# Altium schematic sheet HD3SS460-PORT2.SchDoc
size A3; SheetNumber: 5; SheetTotal: 9
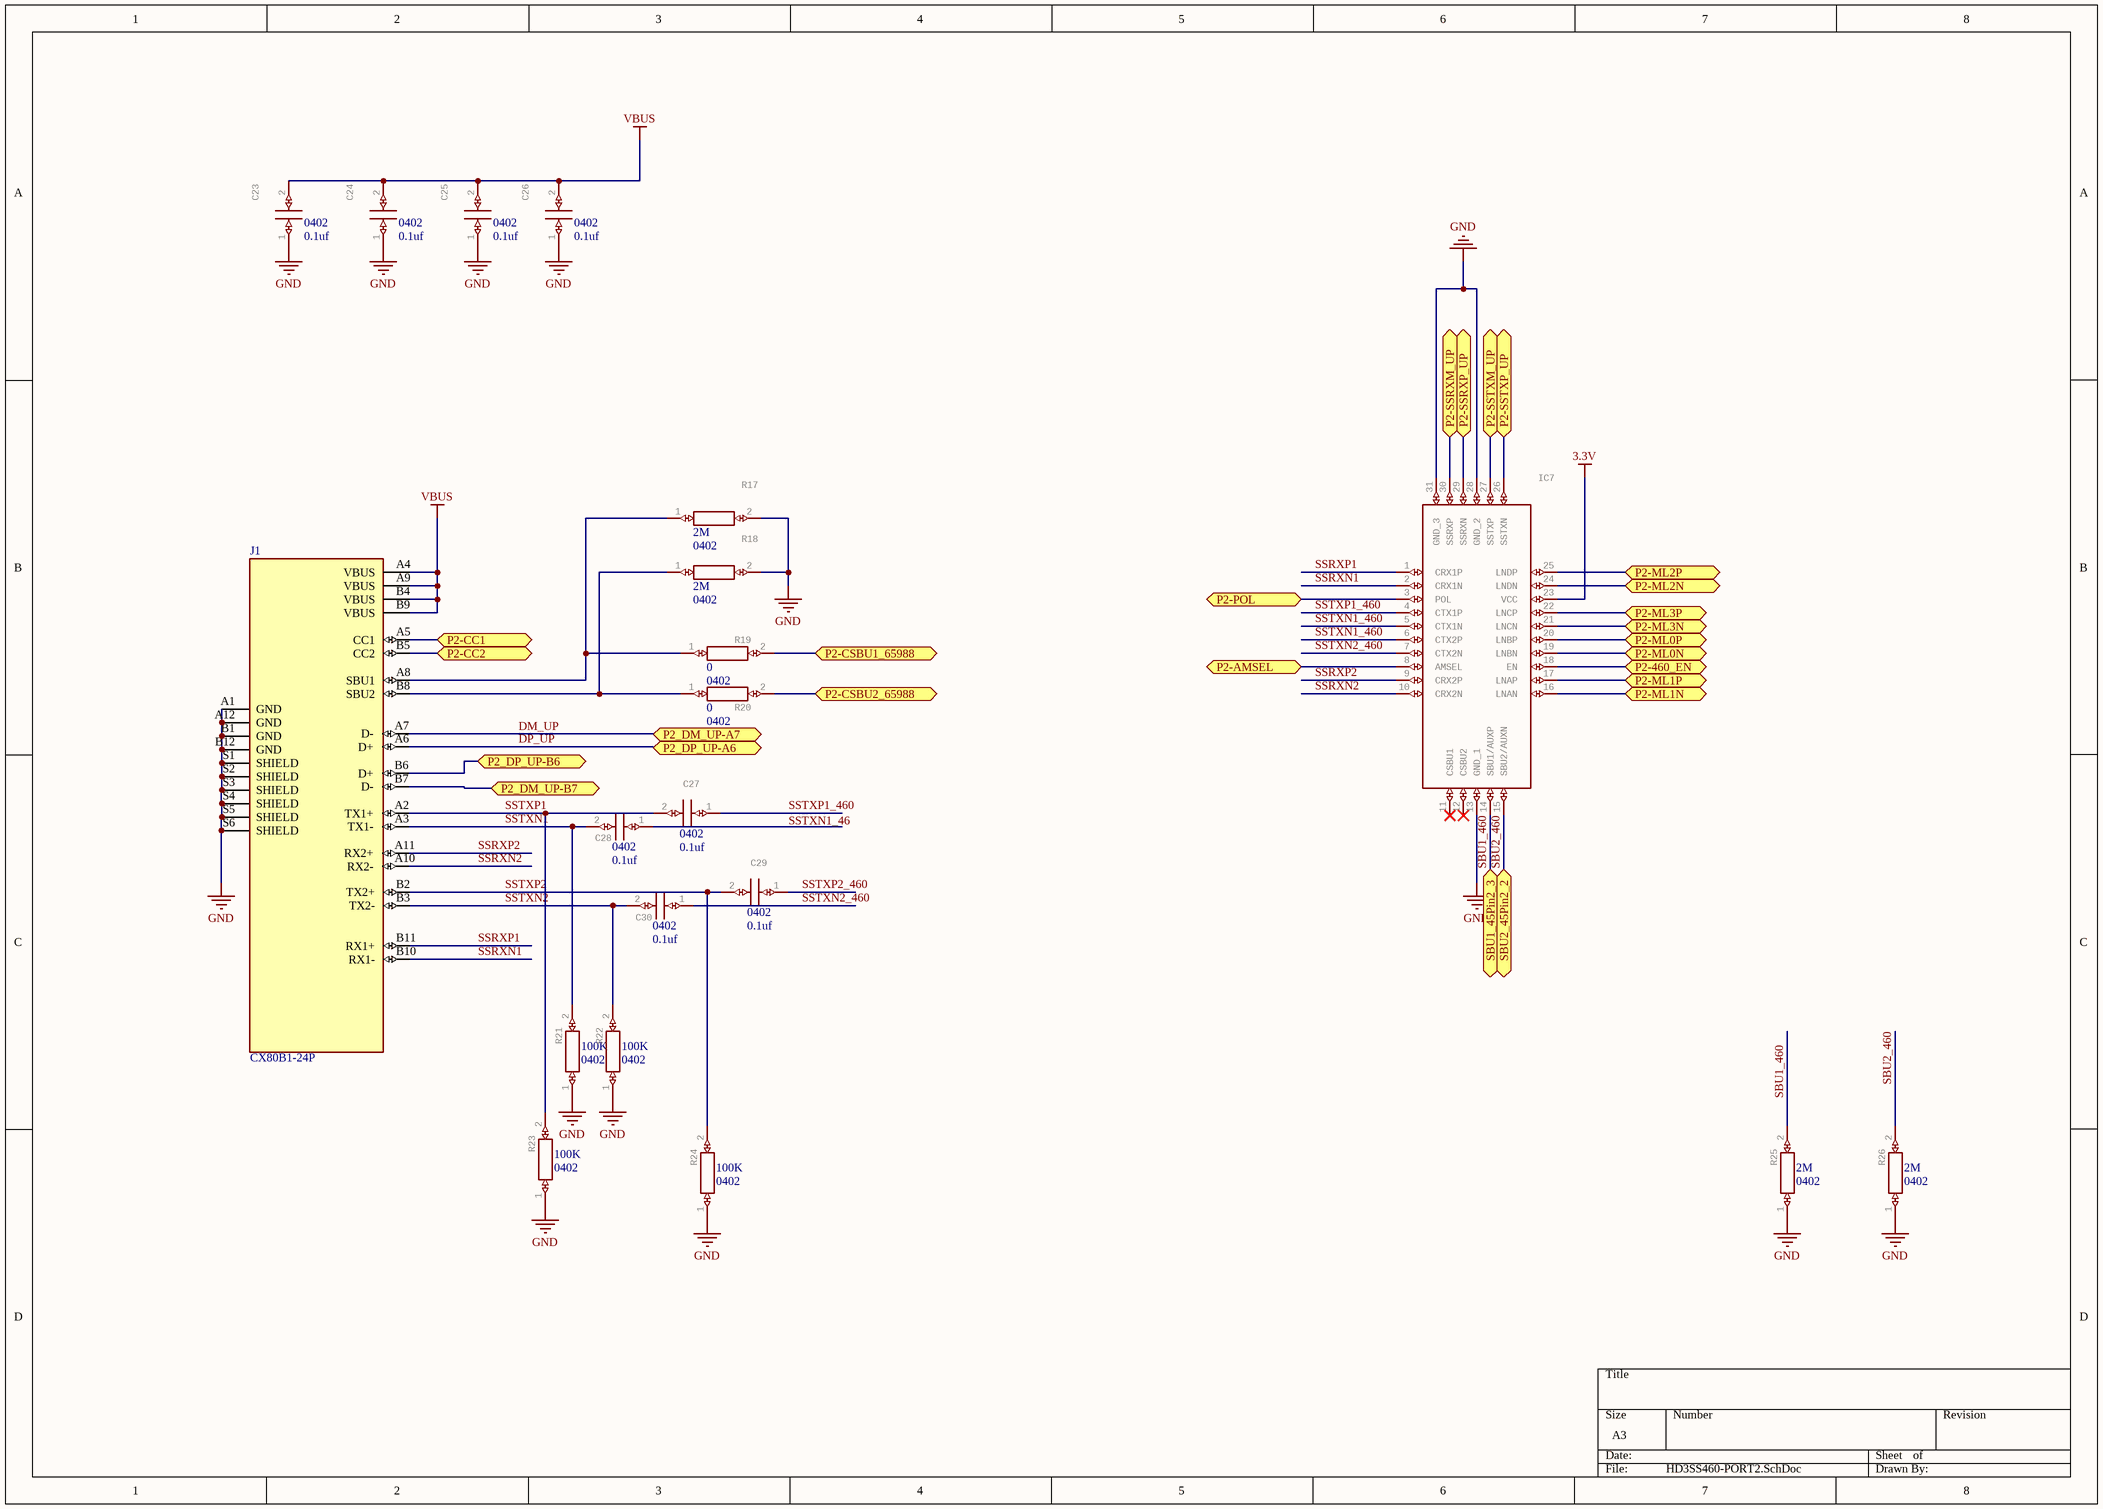
[diagram p0: HD3SS460-PORT2.SchDoc]

## Parts
C23  value 0.1uf  Package: 0402  [CAPC1005X56N]  (hidden comment: Multilayer Ceramic Capacitors MLCC - SMD/SMT 50V .1uF X7R 0402 10% Tol   Source:  Datasheet)
C24  value 0.1uf  Package: 0402  [CAPC1005X56N]  (hidden comment: Multilayer Ceramic Capacitors MLCC - SMD/SMT 50V .1uF X7R 0402 10% Tol   Source:  Datasheet)
C25  value 0.1uf  Package: 0402  [CAPC1005X56N]  (hidden comment: Multilayer Ceramic Capacitors MLCC - SMD/SMT 50V .1uF X7R 0402 10% Tol   Source:  Datasheet)
C26  value 0.1uf  Package: 0402  [CAPC1005X56N]  (hidden comment: Multilayer Ceramic Capacitors MLCC - SMD/SMT 50V .1uF X7R 0402 10% Tol   Source:  Datasheet)
C27  value 0.1uf  Package: 0402  [CAPC1005X56N]  (hidden comment: Multilayer Ceramic Capacitors MLCC - SMD/SMT 50V .1uF X7R 0402 10% Tol   Source:  Datasheet)
C28  value 0.1uf  Package: 0402  [CAPC1005X56N]  (hidden comment: Multilayer Ceramic Capacitors MLCC - SMD/SMT 50V .1uF X7R 0402 10% Tol   Source:  Datasheet)
C29  value 0.1uf  Package: 0402  [CAPC1005X56N]  (hidden comment: Multilayer Ceramic Capacitors MLCC - SMD/SMT 50V .1uF X7R 0402 10% Tol   Source:  Datasheet)
C30  value 0.1uf  Package: 0402  [CAPC1005X56N]  (hidden comment: Multilayer Ceramic Capacitors MLCC - SMD/SMT 50V .1uF X7R 0402 10% Tol   Source:  Datasheet)
IC7  USB Type-C Alternate Mode 4x6 Differential Switch   Source:  Datasheet  [QFN40P250X450X80-31N]  (value not drawn)
J1  CX80B1-24P  [HIROSE_CX80B1-24P]
R17  value 2M  Package: 0402  [RESC1005X40N]  (hidden comment: GENERAL PURPOSE CHIP RESISTORS   Source:  Datasheet)
R18  value 2M  Package: 0402  [RESC1005X40N]  (hidden comment: GENERAL PURPOSE CHIP RESISTORS   Source:  Datasheet)
R19  value 0  Package: 0402  [RESC1005X40N]  (hidden comment: GENERAL PURPOSE CHIP RESISTORS   Source:  Datasheet)
R20  value 0  Package: 0402  [RESC1005X40N]  (hidden comment: GENERAL PURPOSE CHIP RESISTORS   Source:  Datasheet)
R21  value 100K  Package: 0402  [RESC1005X40N]  (hidden comment: GENERAL PURPOSE CHIP RESISTORS   Source:  Datasheet)
R22  value 100K  Package: 0402  [RESC1005X40N]  (hidden comment: GENERAL PURPOSE CHIP RESISTORS   Source:  Datasheet)
R23  value 100K  Package: 0402  [RESC1005X40N]  (hidden comment: GENERAL PURPOSE CHIP RESISTORS   Source:  Datasheet)
R24  value 100K  Package: 0402  [RESC1005X40N]  (hidden comment: GENERAL PURPOSE CHIP RESISTORS   Source:  Datasheet)
R25  value 2M  Package: 0402  [RESC1005X40N]  (hidden comment: GENERAL PURPOSE CHIP RESISTORS   Source:  Datasheet)
R26  value 2M  Package: 0402  [RESC1005X40N]  (hidden comment: GENERAL PURPOSE CHIP RESISTORS   Source:  Datasheet)

## Ports
P2-460_EN (bidir), P2-AMSEL (bidir), P2-CC1 (bidir), P2-CC2 (bidir), P2-CSBU1_65988 (bidir), P2-CSBU2_65988 (bidir), P2-ML0N (bidir), P2-ML0P (bidir), P2-ML1N (bidir), P2-ML1P (bidir), P2-ML2N (bidir), P2-ML2P (bidir), P2-ML3N (bidir), P2-ML3P (bidir), P2-POL (bidir), P2-SSRXM_UP (bidir), P2-SSRXP_UP (bidir), P2-SSTXM_UP (bidir), P2-SSTXP_UP (bidir), P2_DM_UP-A7 (bidir), P2_DM_UP-B7 (bidir), P2_DP_UP-A6 (bidir), P2_DP_UP-B6 (bidir), SBU1_45Pin2_3 (bidir), SBU2_45Pin2_2 (bidir)

## Nets
3.3V: IC7.23(VCC)
GND: C23.1 C24.1 C25.1 C26.1 IC7.13(GND_1) IC7.28(GND_2) IC7.31(GND_3) J1.A1(GND) J1.A12(GND) J1.B1(GND) J1.B12(GND) J1.S1(SHIELD) J1.S2(SHIELD) J1.S3(SHIELD) J1.S4(SHIELD) J1.S5(SHIELD) J1.S6(SHIELD) R17.2 R18.2 R21.1 R22.1 R23.1 R24.1 R25.1 R26.1
VBUS: C23.2 C24.2 C25.2 C26.2 J1.A4(VBUS) J1.A9(VBUS) J1.B4(VBUS) J1.B9(VBUS)
DP_UP: J1.A6(D+)
P2-460_EN: IC7.18(EN) ; port P2-460_EN
P2-AMSEL: IC7.8(AMSEL) ; port P2-AMSEL
P2-CC1: J1.A5(CC1) ; port P2-CC1
P2-CC2: J1.B5(CC2) ; port P2-CC2
P2-CSBU1_65988: R19.2 ; port P2-CSBU1_65988
P2-CSBU2_65988: R20.2 ; port P2-CSBU2_65988
P2-ML0N: IC7.19(LNBN) ; port P2-ML0N
P2-ML0P: IC7.20(LNBP) ; port P2-ML0P
P2-ML1N: IC7.16(LNAN) ; port P2-ML1N
P2-ML1P: IC7.17(LNAP) ; port P2-ML1P
P2-ML2N: IC7.24(LNDN) ; port P2-ML2N
P2-ML2P: IC7.25(LNDP) ; port P2-ML2P
P2-ML3N: IC7.21(LNCN) ; port P2-ML3N
P2-ML3P: IC7.22(LNCP) ; port P2-ML3P
P2-POL: IC7.3(POL) ; port P2-POL
P2-SSRXM_UP: IC7.30(SSRXP) ; port P2-SSRXM_UP
P2-SSRXP_UP: IC7.29(SSRXN) ; port P2-SSRXP_UP
P2-SSTXM_UP: IC7.27(SSTXP) ; port P2-SSTXM_UP
P2-SSTXP_UP: IC7.26(SSTXN) ; port P2-SSTXP_UP
P2_DM_UP-B7: J1.B7(D-) ; port P2_DM_UP-B7
P2_DP_UP-B6: J1.B6(D+) ; port P2_DP_UP-B6
SBU1_460: IC7.14(SBU1/AUXP) R25.2 ; port SBU1_45Pin2_3
SBU2_460: IC7.15(SBU2/AUXN) R26.2 ; port SBU2_45Pin2_2
SSRXN1: IC7.2(CRX1N) J1.B10(RX1-)
SSRXN2: IC7.10(CRX2N) J1.A10(RX2-)
SSRXP1: IC7.1(CRX1P) J1.B11(RX1+)
SSRXP2: IC7.9(CRX2P) J1.A11(RX2+)
SSTXN1: C28.2 J1.A3(TX1-) R21.2
SSTXN1_460: IC7.5(CTX1N) IC7.6(CTX2P)
SSTXN2: C30.2 J1.B3(TX2-) R22.2
SSTXN2_460: C30.1 IC7.7(CTX2N)
SSTXP1: C27.2 J1.A2(TX1+) R23.2
SSTXP1_460: C27.1 IC7.4(CTX1P)
SSTXP2: C29.2 J1.B2(TX2+) R24.2
SSTXP2_460: C29.1
NetJ1_A8: J1.A8(SBU1) R17.1 R19.1
NetJ1_B8: J1.B8(SBU2) R18.1 R20.1

Not connected (* = marked no-connect by the designer): C28 1; IC7 11(CSBU1)* 12(CSBU2)*; J1 A7(D-)

## Notes on the sheet
- Labels drawn without touching a wire or pin: DM_UP, SSTXN1_46

## Library data of the parts
C23-C30 = 04025C104KAT2A: Manufacturer_Name: AVX; GateName_1: G$1; SymbolName_1: 04025C104KAT2A; LibraryName: 04025C104KAT2A; DeviceSetName: 04025C104KAT2A; Manufacturer_Part_Number: 04025C104KAT2A; Mouser_Part_Number: 581-04025C104KAT2A; Mouser_Price-Stock: https://www.mouser.co.uk/ProductDetail/AVX/04025C104KAT2A?qs=ZBeOGGPQgEFYcwOskjAIVQ%3D%3D; Arrow_Part_Number: 04025C104KAT2A; Arrow_Price-Stock: https://www.arrow.com/en/products/04025c104kat2a/avx?region=nac; Height: 0.56mm
IC7 = HD3SS460RNHR: Manufacturer_Name: Texas Instruments; GateName_1: G$1; SymbolName_1: HD3SS460RNHR; LibraryName: HD3SS460RNHR; DeviceSetName: HD3SS460RNHR; Package: QFN40P250X450X80-31N; Manufacturer_Part_Number: HD3SS460RNHR; Mouser_Part_Number: 595-HD3SS460RNHR; Mouser_Price-Stock: https://www.mouser.co.uk/ProductDetail/Texas-Instruments/HD3SS460RNHR?qs=6BVwEky2YVwfkjqmIesFTw%3D%3D; Arrow_Part_Number: HD3SS460RNHR; Arrow_Price-Stock: https://www.arrow.com/en/products/hd3ss460rnhr/texas-instruments; Height: 0.8mm
J1 = CX80B1-24P: USB-C _USB TYPE-C_ USB 3.1 _USB 3.1 Gen 2, Superspeed+_ Receptacle Connector 24 Position Surface Mount, Through Hole; MF: Hirose Electric Co Ltd; SnapEDA_Link: https://www.snapeda.com/parts/CX80B1-24P/Hirose%20Electric%20Co%20Ltd/view-part/3218887/?ref=snap; MP: CX80B1-24P; Package: None; Digi-Key_Part_Number: 26-CX80B1-24PCT-ND; Value: *; Digi-Key_Purchase_URL: https://www.digikey.com/product-detail/en/hirose-electric-co-ltd/CX80B1-24P/26-CX80B1-24PCT-ND/9816162?utm_source=snapeda&utm_medium=aggregator&utm_campaign=symbol
R17-R26 = RC0402FR-071KL: Manufacturer_Name: KEMET; GateName_1: G$1; SymbolName_1: RC0402FR-071KL; LibraryName: RC0402FR-071KL; DeviceSetName: RC0402FR-071KL; Manufacturer_Part_Number: RC0402FR-071KL; Mouser_Part_Number: 603-RC0402FR-071KL; Mouser_Price-Stock: https://www.mouser.co.uk/ProductDetail/YAGEO/RC0402FR-071KL?qs=V1yeUXFNrknDEmWLmm5v6g%3D%3D; Arrow_Part_Number: RC0402FR-071KL; Arrow_Price-Stock: https://www.arrow.com/en/products/rc0402fr-071kl/yageo?region=nac; Height: 0.4mm